# EAGLE design Pico8 (EAGLE 8.3.2)
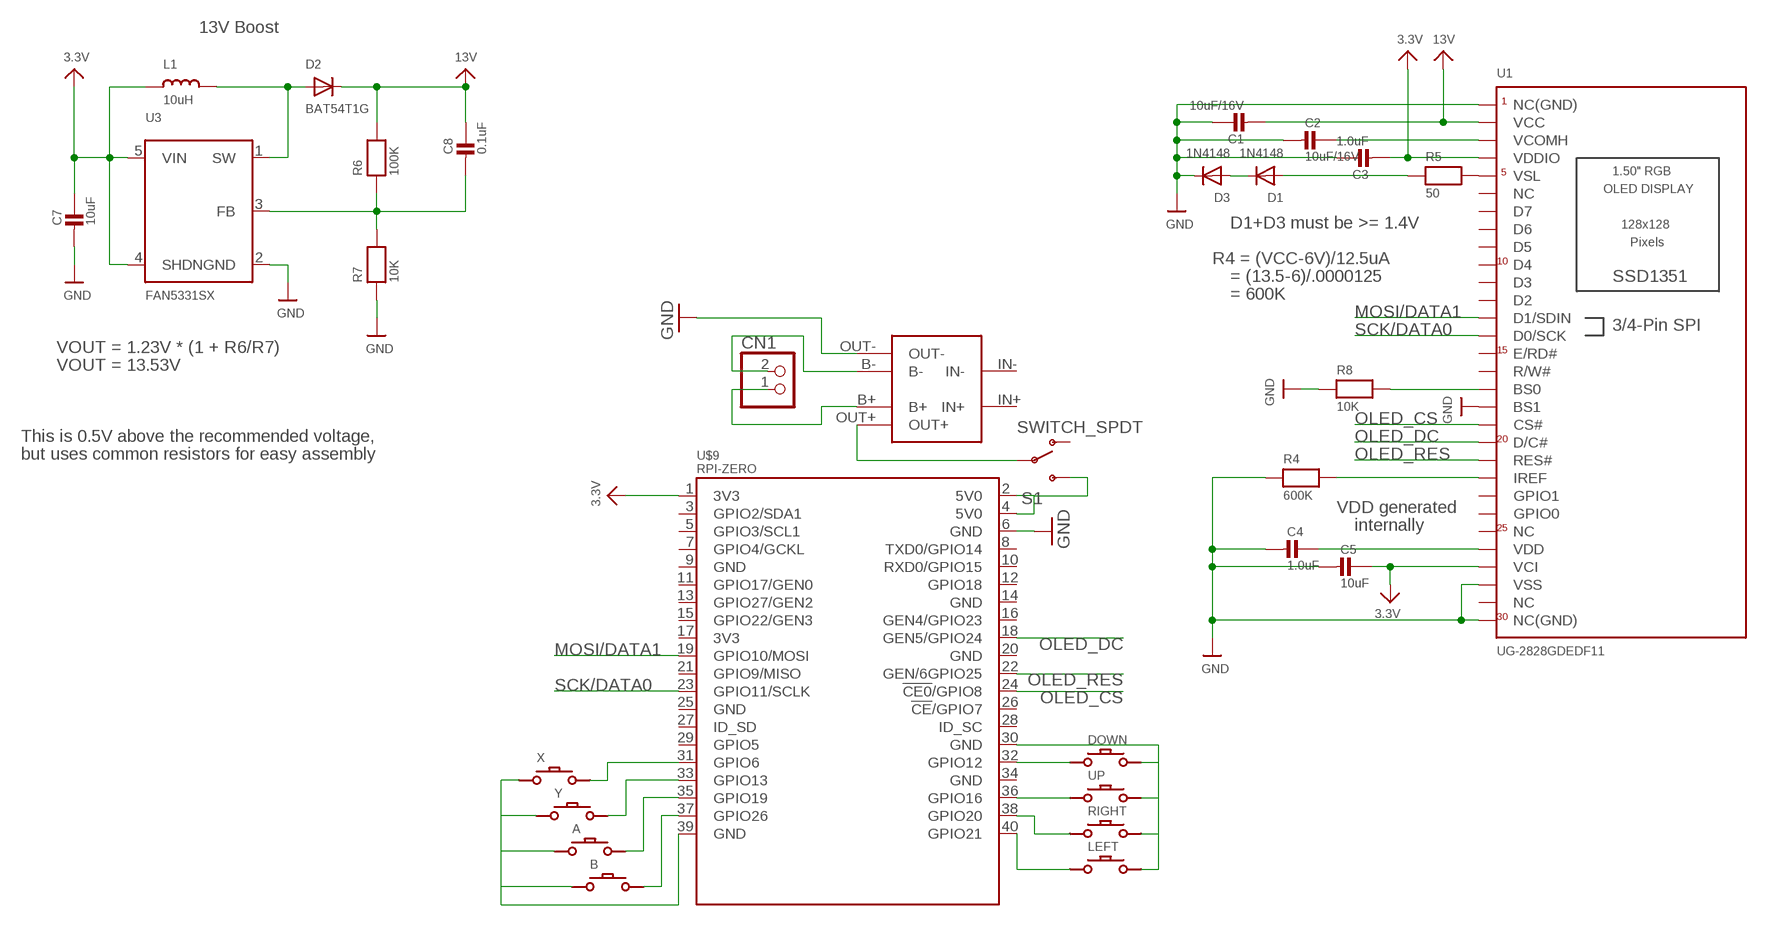
[diagram p0: schematic, sheet 1]

## Parts
A  DMG-BTNREGULAR  [DMG-BTN]
B  DMG-BTNREGULAR  [DMG-BTN]
C1  10uF/16V  CAP_CERAMIC0805  [0805]
C2  10uF/16V  CAP_CERAMIC0805  [0805]
C3  1.0uF  CAP_CERAMIC0805  [0805]
C4  1.0uF  CAP_CERAMIC0805  [0805]
C5  10uF  CAP_CERAMIC0805  [0805]
C7  10uF  CAP_CERAMIC0805  [0805]
C8  0.1uF  CAP_CERAMIC0805  [0805]
CN1  JST_2PIN-SMT-RA  [JST-PH-2-SMT-RA]
D1  1N4148  DIODESOD-323  [SOD-323]
D2  BAT54T1G  DIODESOD-123  [SOD-123]
D3  1N4148  DIODESOD-323  [SOD-323]
DOWN  DMG-BTNREGULAR  [DMG-BTN]
L1  10uH  INDUCTOR  [INDUCTOR_1007]
LEFT  DMG-BTNREGULAR  [DMG-BTN]
POWER1  03962A  [03962A]
R4  600K  RESISTOR0805  [0805]
R5  50  RESISTOR0805  [0805]
R6  100K  RESISTOR0805  [0805]
R7  10K  RESISTOR0805  [0805]
R8  10K  RESISTOR0805  [0805]
RIGHT  DMG-BTNREGULAR  [DMG-BTN]
S1  SWITCH_SPDT  [KPS-1290]
U1  UG-2828GDEDF11  DISP_OLED_UG-2828GDEDF11TOP  [FPC_XF2M-3015-1A]
U3  FAN5331SX  FAN5331  [SOT23-5@1]
U$9  RPI-ZERO  [RASPBERRYPI_BASTELSTUBE_V13_RASPI_BOARD_B+_FULL]
UP  DMG-BTNREGULAR  [DMG-BTN]
X  DMG-BTNREGULAR  [DMG-BTN]
Y  DMG-BTNREGULAR  [DMG-BTN]

## Nets
3.3V: C3.2 C5.1 C7.1 L1.P$1 U1.P$4(VCI) U1.P$27(VDDIO) U3.4(SHDN) U3.5(VIN)
3V3@1: U$9.1(3V3) ; supply symbol labelled 3.3V
5V0@2: S1.S U$9.2(5V0) U$9.4(5V0)
13V: C1.2 C8.1 D2.C R6.2 U1.P$29(VCC)
GND: C1.1 C2.2 C3.1 C4.2 C5.2 C7.2 D3.C POWER1.OUT- R4.1 R7.1 R8.1 U1.P$1(NC(GND)) U1.P$3(VSS) U1.P$13(BS1) U1.P$30(NC(GND)) U3.2(GND)
GND@3: A.P$1 B.P$1 U$9.39(GND) X.P$1 Y.P$1
GND@6: DOWN.P$2 LEFT.P$2 RIGHT.P$2 U$9.30(GND) UP.P$2
GND@8: U$9.6(GND) ; supply symbol labelled GND
IREF: R4.2 U1.P$9(IREF)
MOSI/DATA1: U1.P$18(D1/SDIN) U$9.19(GPIO10/MOSI)
N$1: R8.2 U1.P$14(BS0)
N$2: POWER1.OUT+ S1.P
N$3: C4.1 U1.P$5(VDD)
N$5: D2.A L1.P$2 U3.1(SW)
N$6: R5.2 U1.P$26(VSL)
N$7: D1.A R5.1
N$8: C8.2 R6.1 R7.2 U3.3(FB)
N$11: D1.C D3.A
N$16: LEFT.P$1 U$9.40(GPIO21)
N$17: RIGHT.P$1 U$9.38(GPIO20)
N$19: U$9.36(GPIO16) UP.P$1
N$20: DOWN.P$1 U$9.32(GPIO12)
N$26: B.P$2 U$9.37(GPIO26)
N$27: A.P$2 U$9.35(GPIO19)
N$28: U$9.33(GPIO13) Y.P$2
N$29: U$9.31(GPIO6) X.P$2
N$36: CN1.1 POWER1.B+
N$37: CN1.2 POWER1.B-
OLED_CS: U1.P$12(CS#) U$9.24(!CE0!/GPIO8)
OLED_DC: U1.P$11(D/C#) U$9.18(GEN5/GPIO24)
OLED_RES: U1.P$10(RES#) U$9.22(GEN/6GPIO25)
SCK/DATA0: U1.P$17(D0/SCK) U$9.23(GPIO11/SCLK)
VCOMH: C2.1 U1.P$28(VCOMH)
Unconnected: POWER1.IN+ POWER1.IN- S1.O U1.P$2(NC) U1.P$6(NC) U1.P$7(GPIO0) U1.P$8(GPIO1) U1.P$15(R/W#) U1.P$16(E/RD#) U1.P$19(D2) U1.P$20(D3) U1.P$21(D4) U1.P$22(D5) U1.P$23(D6) U1.P$24(D7) U1.P$25(NC) U$9.3(GPIO2/SDA1) U$9.5(GPIO3/SCL1) U$9.7(GPIO4/GCKL) U$9.8(TXD0/GPIO14) U$9.9(GND) U$9.10(RXD0/GPIO15) U$9.11(GPIO17/GEN0) U$9.12(GPIO18) U$9.13(GPIO27/GEN2) U$9.14(GND) U$9.15(GPIO22/GEN3) U$9.16(GEN4/GPIO23) U$9.17(3V3) U$9.20(GND) U$9.21(GPIO9/MISO) U$9.25(GND) U$9.26(!CE!/GPIO7) U$9.27(ID_SD) U$9.28(ID_SC) U$9.29(GPIO5) U$9.34(GND)

## Notes on the sheet
- 13V Boost
- D1+D3 must be >= 1.4V
- R4 = (VCC-6V)/12.5uA
- = (13.5-6)/.0000125
- = 600K
- VOUT = 1.23V * (1 + R6/R7)
- VOUT = 13.53V
- This is 0.5V above the recommended voltage,
- but uses common resistors for easy assembly
- VDD generated
- internally

## Library data of the parts
A B DOWN LEFT RIGHT UP X Y = Game_Boy:DMG-BTN
C1-C5 C7 C8 = microbuilder:CAP_CERAMIC: Ceramic Capacitors For new designs, use the packages preceded by an '_' character since they are more reliable: The following footprints should be used on most boards: _0402 - Standard footprint for regular board layouts _0603 - Standard footprint for regular board layouts _0805 - Standard footprint for regular board layouts For extremely tight-pitch boards where space is at a premium, the following 'micro-pitch' footprints can be used (smaller pads, no silkscreen outline, etc.): _0402MP - Micro-pitch footprint for very dense/compact boards _0603MP - Micro-pitch footprint for very dense/compact boards _0805MP - Micro-pitch footprint for very dense/compact boards Commonly Stocked Parts 0402 - 0402 Surface Mount Capacitors 16pF 50V 5% [Digikey: 445-4899-2-ND] 18pF 50V 5% [Digikey: 490-1281-2-ND] 22pF 50V 5% [Digikey: 490-1283-2-ND] 68pF 50V 5% [Digikey: 490-1289-2-ND] 0.1uF 10V 10% [Digikey: 490-1318-2-ND] 1.0uF 6.3V 10% [Digikey: 490-1320-2-ND] 0603 - 0603 Surface Mount Capacitors 16 pF 50V 5% [Digikey: 445-5051-2-ND] 22 pF 50V [Digikey: PCC220ACVTR-ND] 33 pF 50V 5% [Digikey: 490-1415-1-ND] 56pF 50V 5% [Digikey: 490-1421-1-ND] 220pF 50V 5% [Digikey: 445-1285-1-ND] 680 pF 50V 2200 pF 50V 5% C0G [Digikey: 445-1297-1-ND] 5600 pF 100V 5% X7R [Digikey: 478-3711-1-ND] 0.1 µF 25V 10% [Digikey: PCC2277TR-ND] 0.22 µF 16V 10% X7R [Digikey: 445-1318-1-ND] 1.0 µF 25V 10% [Digikey: 445-5146-2-ND] 0603 - RF Specific 3pF 250V +/-0.1pF RF [Digikey: 712-1347-1-ND] 18 pF 250V 5% [Digikey: 478-3505-1-ND or 712-1322-1-ND] 56 pF 250V 5% C0G RF [Digikey: 490-4867-1-ND] 68 pF 250V RF [Digikey: 490-4868-1-ND] 0805 - 0805 Surface Mount Capacitors 220 pF 250V 2% RF Ceramic Capacitor [Digikey: 712-1398-1-ND] 1000 pF 50V 2% NP0 Ceramic Capacitor [Digikey: 478-3760-1-ND] 0.1 µF 25V 10% Ceramic Capacitor [Digikey: PCC1828TR-ND] 1.0 µF 16V 10% Ceramic Capacitor[Digikey: 490-1691-2-ND] 10.0 µF 10V 10% Ceramic Capacitor[Digikey: 709-1228-1-ND] 10.0 uF 16V 10% Ceramic Capacitor [Digikey: 478-5165-2-ND] 47 uF 6.3V 20% Ceramic Capacitor [Digikey: 587-1779-1-ND or 399-5506-1-ND] 1206 - 1206 Surface Mount Capacitors 47uF 10V 20% Ceramic Capacitor [Digikey: 490-5528-1-ND or 399-5508-1-ND or 445-6010-1-ND] 100uF 6.3V -20%, +80% Y5V Ceramic Capacitor (Digikey: 490-4512-1-ND, Mouser: 81-GRM31CF50J107ZE1L)
CN1 = adafruit:JST_2PIN: JST 2-Pin Connectors of various flavors SMT-RA (S2B-PH-SM4) 4UConnector #17311 SMT (B2B-PH-SM4) THM-RA (S2B-PH) THM (B2B-PH)
D1-D3 = microbuilder:DIODE: Diode SMA Model Volts Amps Type Vf Vr Digikey # Notes SSA34-E3 40V 3A Schottky 480mV @ 3A 200uA @ 40V SSA34-E3/61TGITR-ND CDBA120-G 20V 1A Schottky 500mV @ 1A 500uA @ 20V 641-1014-6-ND REEL MBRA210 10V 2A Schottky 350mV @ 2A 700uA @ 10V MBRA210LT3 SOD-123 Model Volts Amps Type Vf Vr Order # Notes BAT54T1G 30V 200mA Schottky 800mV @ 200mA 2uA @ 25V BAT54T1GOSTR-ND B0530W 30V 500mA Schottky 430mV @ 500mA 130uA @ 30V B0530W-FDICT-ND REEL MBR120 20V 1A Schottky 340mV @ 1A MBR120VLSFT1GOSCT-ND SOD-323 Model Volts Amps Type Vf Vr Order # Notes PMEG2005EJ 20V 500mA Schottky 355mV @ 500mA 568-4110-1-ND ZLLS410 10V 570mA Schottky 380mV @ 570mA ZLLS410CT-ND 1N4148WS 75V 150mA Silicon/Simple 1V 1N4148WSFSCT-ND REEL SOD-523 Model Volts Amps Type Vf Vr Order # Notes BAT54XV2 30V 200mA Schottky 0.8V @ 100mA BAT54XV2CT-ND TB751S 30V 30mA Schottky RB751S-40TE61CT-ND SOT23-R/W (R = Solder Paste/Reflow Ovens, W = Hand-Soldering) Model Volts Amps Type Vf Vr Order # Notes BAT54FILM 40V 300mA Schottky 497-7162-1-ND
L1 = microbuilder:INDUCTOR: Inductors 0603: 10nH Ceramic Inductor - microwire antenna/RF (Digikey: 712-1434-2-ND) 0805: 560nH Ceramic Inductor - RF (Digikey: 553-1047-1-ND) 270nH Ceramic Inductor - Q = 40@250MHz, +-5%, 1 Ohm DC Resistance (Digikey: 535-10506-2-ND) 1007 (2518 Metric) SMT: 10µH 10% 250mOhm 820mA 1007 Inductor (Digikey: 587-2189-1-ND) 22µH 10% 500mOhm 580mA 1007 Inductor (Digikey: 587-2190-1-ND) 47µH 10% 950mOhm 420mA 1007 Inductor (Digikey: 587-2191-1-ND) 47µH 5% 100mOhm 1A 1008 Inductor (Digikey: 732-1816-1-ND) 5.0x5.0mm (Taiyo Yuden NR5040 Series) 6.8µH 20% 2.3A 64mOhm Inductor (Digikey: 587-2374-2-ND) 5.0x5.0mm (TDK VLC5045 Series) 4.7µH 20% 3.3A 34mOhm Inductor (Digikey: 445-6526-1-ND) 6.8µH 20% 2.7A 46mOhm Inductor (Digikey: 445-6527-1-ND) 6.0x6.0mm (TDK VLC6045 Series) 4.7µH 20% 3.8A 27mOhm Inductor (Digikey: 445-6538-2-ND) 6.8µH 20% 3A 41mOhm Inductor (Digikey: 445-6540-1-ND) 6.2µH 30% 2.2A 45mOhm Inductor (Digikey: SRR5028-6R2YCT-ND) - Not TDK VLC6045 but footprint should match 6.0x6.0mm (TDK SLF6045 Series) 6.8uH 30% 2A 33mOhm Inductor (Digikey: 445-4572-1-ND, Mouser: 810-SLF645T6R8N2R0PF) 6.0x6.0mm (Sumida CDRH5D28 Series) 6.2uH 30% 1.8A 45mOhm Inductor (Digikey: 308-1542-1-ND) Taiyo Yuden NR3015T2R2M - 2.2uH 20% 1.5A (Digikey: 587-1648-2-ND, Mouser: 963-NR3015T2R2M) - Used with TI TPS62172 CoilCraft RFID Transponder Coil - MA5532-AE (For use with AS3935 Lightning Sensor)
POWER1 = 03962A:03962A
R4-R8 = microbuilder:RESISTOR: Resistors For new designs, use the packages preceded by an '_' character since they are more reliable: The following footprints should be used on most boards: _0402 - Standard footprint for regular board layouts _0603 - Standard footprint for regular board layouts _0805 - Standard footprint for regular board layouts For extremely tight-pitch boards where space is at a premium, the following 'micro-pitch' footprints can be used (smaller pads, no silkscreen outline, etc.): _0402MP - Micro-pitch footprint for very dense/compact boards _0603MP - Micro-pitch footprint for very dense/compact boards _0805MP - Micro-pitch footprint for very dense/compact boards
S1 = SparkFun-Electromechanical:SWITCH_SPDT: SWCH-10651 Side-actuated SPDT slide switch, as used on the Arduino Pro; PROD_ID: SWCH-10651
U1 = microbuilder:DISP_OLED_UG-2828GDEDF11: 128x128 1.5" RGB OLED - UG-2828GDEDF11 30-Pin 0.5mm Pitch FPC Cable (Top+Bottom Contacts) - OMRON XF2M-3015-1A (Digikey: OR723TR-ND) This FPC connector has contacts on the top and bottom, but the appropriate pin needs to be selected depending on whether the OLED will be inserted right-side up (use the TOP pinout) or upside-down (use the BOTTOM pinout).
U3 = microbuilder:FAN5331: FAN5331 - LED/OLED 20V Boost Converter Digikey: FAN5331SXCT-ND
U$9 = RPI-Zero-Head:RPI-ZERO

## Board
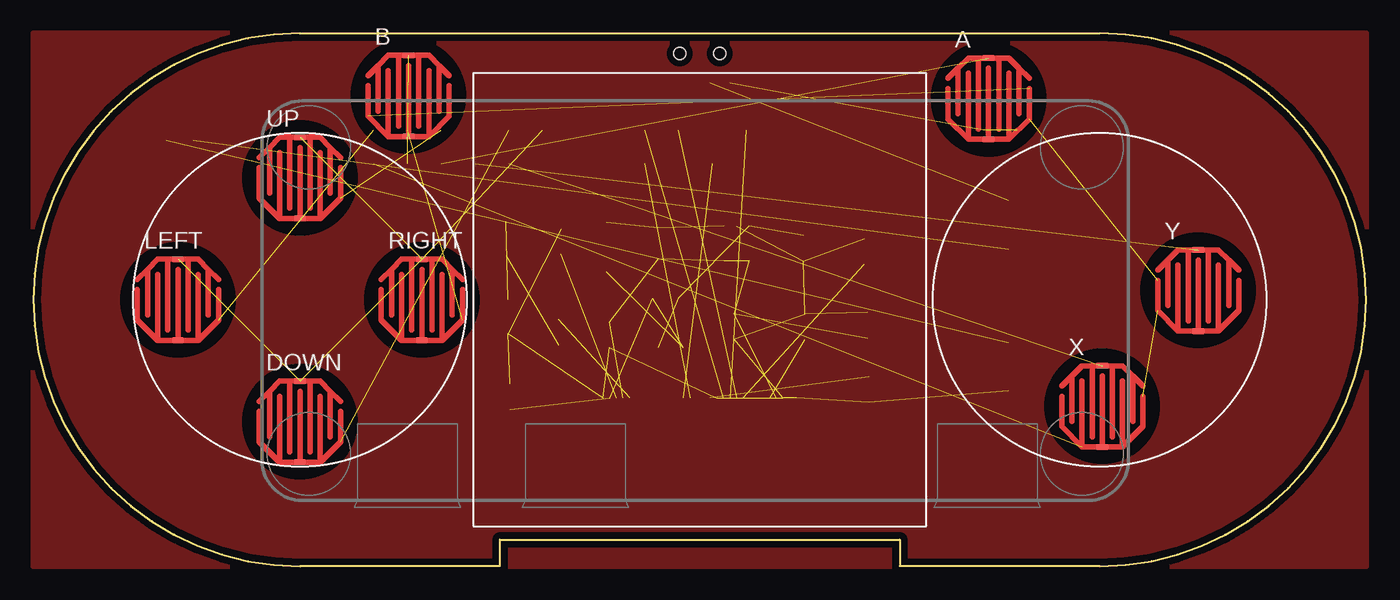
[diagram p1: board, top side]
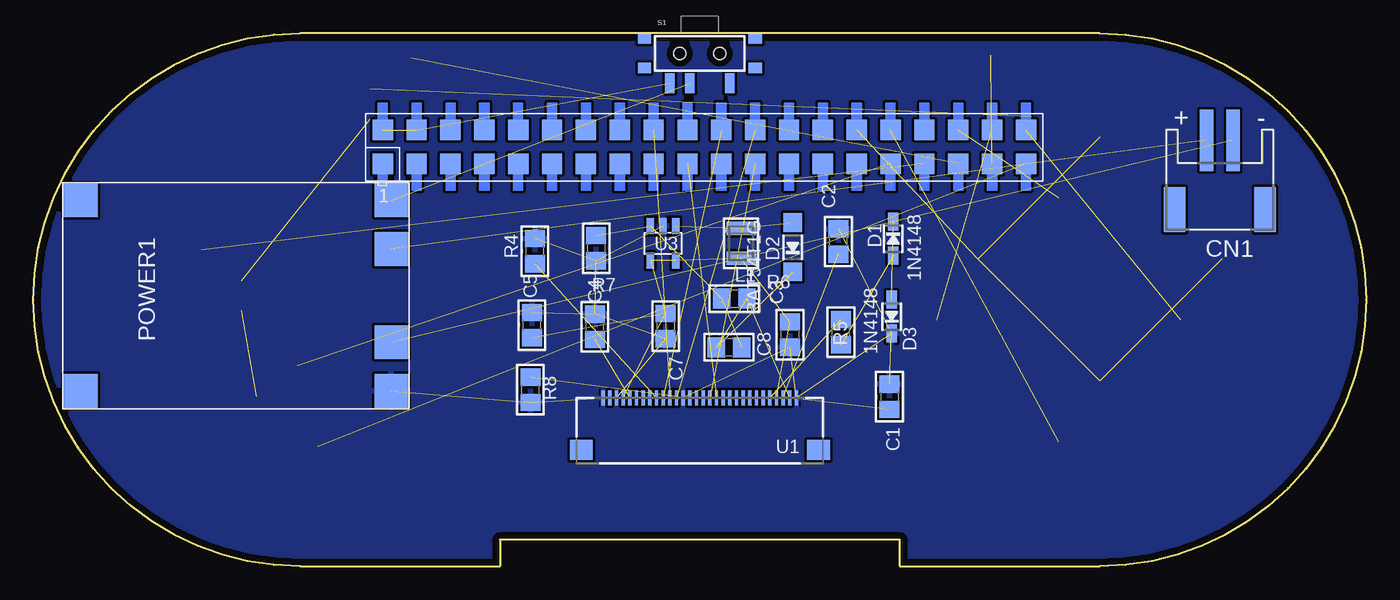
[diagram p2: board, bottom side, seen from below]

Size 100 x 40 mm. Coordinates in mm from the lower left corner, seen from the top.
Outline: 20,40 80,40 arc-180 80,0 65,0 65,2 35,2 35,0 20,0 arc-180 20,40
Copper layers (1*16): Top 0.035mm / dielectric 1.5mm / Bottom 0.035mm
Design rules "PCBCart-Standard *": minimum track width 8mil, minimum drill 0.4mm, track to track 8mil, track to pad 8mil, pad to pad 8mil, via to via 8mil, smd to smd 8mil, copper to edge 20mil, drill to drill 8mil, minimum pad ring 8mil, minimum via ring 10mil, stop-mask expansion 3mil, vias tented up to drill 20mil, thermal gap 8mil
bRestrict: area 48.2,47.2 to 48.4,47.7; area 46,47.6 to 46.5,47.8

### Footprints (pad centres in the part's own frame; a part is rotated, then mirrored left to right if it is on the bottom)
DMG-BTN = smd 0.813 x 0.406: P$1 0,-3.048; P$2 0,3.048
0805 = smd 1.3 x 1.5: 1 -0.95,0; 2 0.95,0
JST-PH-2-SMT-RA = smd 1 x 4.6: 1 1,-3.7; 2 -1,-3.7 | smd 1.6 x 3.4: NC1 -3.4,1.5; NC2 3.4,1.5
SOD-323 = smd 1.35 x 0.8: A 1.27,0; C -1.27,0
SOD-123 = smd 1.4 x 1.4: A 1.85,0; C -1.85,0
INDUCTOR_1007 = smd 1.016 x 2.2: P$1 -1.127,0; P$2 1.127,0
03962A = smd 2.54 x 2.54: B+ 12,1.35; B- 5,1.35; IN+ 15.65,24.65; IN- 1.35,24.65; OUT+ 15.65,1.35; OUT- 1.35,1.35
KPS-1290 = smd 0.7 x 1.5: O -2.25,2.25; P 0.75,2.25; S 2.25,2.25 | smd 1 x 0.8: P$1 -4.15,1.1; P$2 -4.15,-1.1; P$3 4.15,-1.1; P$4 4.15,1.1 | hole 0.9: -1.5,0; 1.5,0
FPC_XF2M-3015-1A = smd 0.25 x 1.1: P$1 7.25,-2.63; P$2 6.75,-2.63; P$3 6.25,-2.63; P$4 5.75,-2.63; P$5 5.25,-2.63; P$6 4.75,-2.63; P$7 4.25,-2.63; P$8 3.75,-2.63; P$9 3.25,-2.63; P$10 2.75,-2.63; P$11 2.25,-2.63; P$12 1.75,-2.63; P$13 1.25,-2.63; P$14 0.75,-2.63; P$15 0.25,-2.63; P$16 -0.25,-2.63; P$17 -0.75,-2.63; P$18 -1.25,-2.63; P$19 -1.75,-2.63; P$20 -2.25,-2.63; P$21 -2.75,-2.63; P$22 -3.25,-2.63; P$23 -3.75,-2.63; P$24 -4.25,-2.63; P$25 -4.75,-2.63; P$26 -5.25,-2.63; P$27 -5.75,-2.63; P$28 -6.25,-2.63; P$29 -6.75,-2.63; P$30 -7.25,-2.63 | smd 1.7 x 1.5: SUPPORT1 8.9,1.27; SUPPORT2 -8.9,1.27
SOT23-5@1 = smd 0.55 x 1.2: 1 -0.95,-1.3; 2 0,-1.3; 3 0.95,-1.3; 4 0.95,1.3; 5 -0.95,1.3
RASPBERRYPI_BASTELSTUBE_V13_RASPI_BOARD_B+_FULL = smd 1.524 x 1.524: 1 8.382,25.273; 2 8.382,27.813; 3 10.922,25.273; 4 10.922,27.813; 5 13.462,25.273; 6 13.462,27.813; 7 16.002,25.273; 8 16.002,27.813; 9 18.542,25.273; 10 18.542,27.813; 11 21.082,25.273; 12 21.082,27.813; 13 23.622,25.273; 14 23.622,27.813; 15 26.162,25.273; 16 26.162,27.813; 17 28.702,25.273; 18 28.702,27.813; 19 31.242,25.273; 20 31.242,27.813; 21 33.782,25.273; 22 33.782,27.813; 23 36.322,25.273; 24 36.322,27.813; 25 38.862,25.273; 26 38.862,27.813; 27 41.402,25.273; 28 41.402,27.813; 29 43.942,25.273; 30 43.942,27.813; 31 46.482,25.273; 32 46.482,27.813; 33 49.022,25.273; 34 49.022,27.813; 35 51.562,25.273; 36 51.562,27.813; 37 54.102,25.273; 38 54.102,27.813; 39 56.642,25.273; 40 56.642,27.813

### Placement (x,y rotation side)
A  71.67,35.09 0 top
B  28.15,35.3 0 top
C1  35.77,12.72 270 bottom
C2  39.6,24.37 90 bottom
C3  43.23,17.38 90 bottom
C4  57.88,17.97 90 bottom
C5  62.6,18.09 90 bottom
C7  52.56,18.02 270 bottom
C8  47.81,16.44 0 bottom
CN1  10.99,28.27 180 bottom
D1  35.49,24.58 270 bottom
D2  43.02,23.94 90 bottom
D3  35.61,18.73 90 bottom
DOWN  20,10.85 0 top
L1  46.9,24.24 90 bottom
LEFT  10.85,20 0 top
POWER1  71.79,11.81 90 bottom
R4  62.37,23.65 270 bottom
R5  39.41,17.57 90 bottom
R6  47.41,20.08 0 bottom
R7  57.77,23.87 90 bottom
R8  62.71,13.24 90 bottom
RIGHT  29.15,20 0 top
S1  50,38.5 180 bottom
U1  50,10 180 bottom
U3  52.75,24.23 180 bottom
U$9  82.17,4.93 0 bottom
UP  20,29.15 0 top
X  80.2,12 0 top
Y  87.4,20.7 0 top

### Tracks (layer width: path | path; a pad name or v marks a point on that pad's centre or on a via)
3.3V  (7 unrouted)
5V0@2  (2 unrouted)
13V  (4 unrouted)
GND  (15 unrouted)
  pour Bottom (isolate 0.203): 100,40 0,40 0,0 100,0
  pour Top (isolate 0.203): 100,40 0,40 0,0 100,0
GND@3  (4 unrouted)
GND@6  (4 unrouted)
IREF  (1 unrouted)
MOSI/DATA1  (1 unrouted)
N$1  (1 unrouted)
N$2  (1 unrouted)
N$3  (1 unrouted)
N$5  (2 unrouted)
N$6  (1 unrouted)
N$7  (1 unrouted)
N$8  (3 unrouted)
N$11  (1 unrouted)
N$16  (1 unrouted)
N$17  (1 unrouted)
N$19  (1 unrouted)
N$20  (1 unrouted)
N$26  (1 unrouted)
N$27  (1 unrouted)
N$28  (1 unrouted)
N$29  (1 unrouted)
N$36  (1 unrouted)
N$37  (1 unrouted)
OLED_CS  (1 unrouted)
OLED_DC  (1 unrouted)
OLED_RES  (1 unrouted)
SCK/DATA0  (1 unrouted)
VCOMH  (1 unrouted)